# Altium schematic sheet lcd.SchDoc: 4.3" LCD - touchscreen
size A3; Author: Francesco Sacchi <batt@develer.com>; Organization: Develer s.r.l.; Address1: via Mugellese 1/A; Address2: 50019 Campi Bisenzio; Address3: Firenze; Address4: ITALY; DocumentNumber: 1; Revision: 0; SheetNumber: 1; SheetTotal: 6
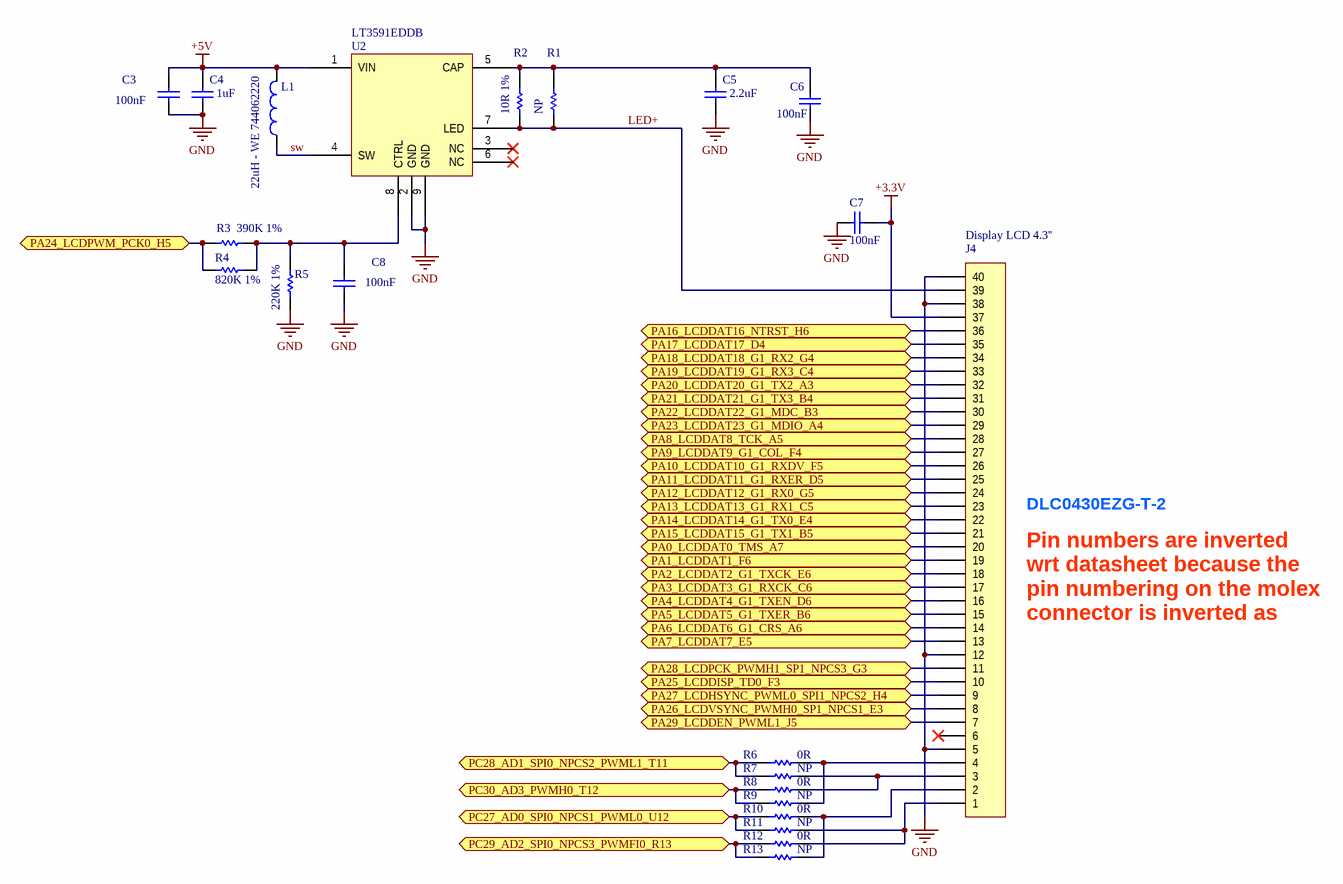
[diagram p0: lcd.SchDoc]

## Parts
C3  100nF  [0603_[1608]]
C4  1uF  [0603_[1608]]
C5  2.2uF  [1210_[3225]]
C6  100nF  [0603_[1608]]
C7  100nF  [0603_[1608]]
C8  100nF  [0603_[1608]]
J4  Display LCD 4.3''  [fcc-zif_40pin_0.5mm]
L1  22uH - WE 744062220  [WE-TPC-6823-X]
R1  NP  [0603_[1608]]
R2  10R 1%  [0603_[1608]]
R3  390K 1%  [0603_[1608]]
R4  820K 1%  [0603_[1608]]
R5  220K 1%  [0603_[1608]]
R6  0R  [0603_[1608]]
R7  NP  [0603_[1608]]
R8  0R  [0603_[1608]]
R9  NP  [0603_[1608]]
R10  0R  [0603_[1608]]
R11  NP  [0603_[1608]]
R12  0R  [0603_[1608]]
R13  NP  [0603_[1608]]
U2  LT3591EDDB  [PQFN50P300X200X75_HS-9L]

## Ports
PA0_LCDDAT0_TMS_A7, PA1_LCDDAT1_F6, PA2_LCDDAT2_G1_TXCK_E6, PA3_LCDDAT3_G1_RXCK_C6, PA4_LCDDAT4_G1_TXEN_D6, PA5_LCDDAT5_G1_TXER_B6, PA6_LCDDAT6_G1_CRS_A6, PA7_LCDDAT7_E5, PA8_LCDDAT8_TCK_A5, PA9_LCDDAT9_G1_COL_F4, PA10_LCDDAT10_G1_RXDV_F5, PA11_LCDDAT11_G1_RXER_D5, PA12_LCDDAT12_G1_RX0_G5, PA13_LCDDAT13_G1_RX1_C5, PA14_LCDDAT14_G1_TX0_E4, PA15_LCDDAT15_G1_TX1_B5, PA16_LCDDAT16_NTRST_H6, PA17_LCDDAT17_D4, PA18_LCDDAT18_G1_RX2_G4, PA19_LCDDAT19_G1_RX3_C4, PA20_LCDDAT20_G1_TX2_A3, PA21_LCDDAT21_G1_TX3_B4, PA22_LCDDAT22_G1_MDC_B3, PA23_LCDDAT23_G1_MDIO_A4, PA24_LCDPWM_PCK0_H5, PA25_LCDDISP_TD0_F3, PA26_LCDVSYNC_PWMH0_SP1_NPCS1_E3, PA27_LCDHSYNC_PWML0_SPI1_NPCS2_H4, PA28_LCDPCK_PWMH1_SP1_NPCS3_G3, PA29_LCDDEN_PWML1_J5, PC27_AD0_SPI0_NPCS1_PWML0_U12, PC28_AD1_SPI0_NPCS2_PWML1_T11, PC29_AD2_SPI0_NPCS3_PWMFI0_R13, PC30_AD3_PWMH0_T12

## Nets
+3.3V: C7.1 J4.37
+5V: C3.2 C4.2 L1.2 U2.1(VIN)
GND: C3.1 C4.1 C5.1 C6.1 C7.2 C8.1 J4.5 J4.12 J4.38 J4.40 R5.2 U2.2(GND) U2.9(GND)
LED+: J4.39 R1.1 R2.1 U2.7(LED)
PA0_LCDDAT0_TMS_A7: J4.20 ; port PA0_LCDDAT0_TMS_A7
PA1_LCDDAT1_F6: J4.19 ; port PA1_LCDDAT1_F6
PA2_LCDDAT2_G1_TXCK_E6: J4.18 ; port PA2_LCDDAT2_G1_TXCK_E6
PA3_LCDDAT3_G1_RXCK_C6: J4.17 ; port PA3_LCDDAT3_G1_RXCK_C6
PA4_LCDDAT4_G1_TXEN_D6: J4.16 ; port PA4_LCDDAT4_G1_TXEN_D6
PA5_LCDDAT5_G1_TXER_B6: J4.15 ; port PA5_LCDDAT5_G1_TXER_B6
PA6_LCDDAT6_G1_CRS_A6: J4.14 ; port PA6_LCDDAT6_G1_CRS_A6
PA7_LCDDAT7_E5: J4.13 ; port PA7_LCDDAT7_E5
PA8_LCDDAT8_TCK_A5: J4.28 ; port PA8_LCDDAT8_TCK_A5
PA9_LCDDAT9_G1_COL_F4: J4.27 ; port PA9_LCDDAT9_G1_COL_F4
PA10_LCDDAT10_G1_RXDV_F5: J4.26 ; port PA10_LCDDAT10_G1_RXDV_F5
PA11_LCDDAT11_G1_RXER_D5: J4.25 ; port PA11_LCDDAT11_G1_RXER_D5
PA12_LCDDAT12_G1_RX0_G5: J4.24 ; port PA12_LCDDAT12_G1_RX0_G5
PA13_LCDDAT13_G1_RX1_C5: J4.23 ; port PA13_LCDDAT13_G1_RX1_C5
PA14_LCDDAT14_G1_TX0_E4: J4.22 ; port PA14_LCDDAT14_G1_TX0_E4
PA15_LCDDAT15_G1_TX1_B5: J4.21 ; port PA15_LCDDAT15_G1_TX1_B5
PA16_LCDDAT16_NTRST_H6: J4.36 ; port PA16_LCDDAT16_NTRST_H6
PA17_LCDDAT17_D4: J4.35 ; port PA17_LCDDAT17_D4
PA18_LCDDAT18_G1_RX2_G4: J4.34 ; port PA18_LCDDAT18_G1_RX2_G4
PA19_LCDDAT19_G1_RX3_C4: J4.33 ; port PA19_LCDDAT19_G1_RX3_C4
PA20_LCDDAT20_G1_TX2_A3: J4.32 ; port PA20_LCDDAT20_G1_TX2_A3
PA21_LCDDAT21_G1_TX3_B4: J4.31 ; port PA21_LCDDAT21_G1_TX3_B4
PA22_LCDDAT22_G1_MDC_B3: J4.30 ; port PA22_LCDDAT22_G1_MDC_B3
PA23_LCDDAT23_G1_MDIO_A4: J4.29 ; port PA23_LCDDAT23_G1_MDIO_A4
PA24_LCDPWM_PCK0_H5: R3.2 R4.1 ; port PA24_LCDPWM_PCK0_H5
PA25_LCDDISP_TD0_F3: J4.10 ; port PA25_LCDDISP_TD0_F3
PA26_LCDVSYNC_PWMH0_SP1_NPCS1_E3: J4.8 ; port PA26_LCDVSYNC_PWMH0_SP1_NPCS1_E3
PA27_LCDHSYNC_PWML0_SPI1_NPCS2_H4: J4.9 ; port PA27_LCDHSYNC_PWML0_SPI1_NPCS2_H4
PA28_LCDPCK_PWMH1_SP1_NPCS3_G3: J4.11 ; port PA28_LCDPCK_PWMH1_SP1_NPCS3_G3
PA29_LCDDEN_PWML1_J5: J4.7 ; port PA29_LCDDEN_PWML1_J5
PC27_AD0_SPI0_NPCS1_PWML0_U12: R10.2 R11.2 ; port PC27_AD0_SPI0_NPCS1_PWML0_U12
PC28_AD1_SPI0_NPCS2_PWML1_T11: R6.2 R7.2 ; port PC28_AD1_SPI0_NPCS2_PWML1_T11
PC29_AD2_SPI0_NPCS3_PWMFI0_R13: R12.2 R13.2 ; port PC29_AD2_SPI0_NPCS3_PWMFI0_R13
PC30_AD3_PWMH0_T12: R8.2 R9.2 ; port PC30_AD3_PWMH0_T12
sw: L1.1 U2.4(SW)
NetC5_2: C5.2 C6.2 R1.2 R2.2 U2.5(CAP)
NetC8_2: C8.2 R3.1 R4.2 R5.1 U2.8(CTRL)
NetJ4_1: J4.1 R11.1 R12.1
NetJ4_2: J4.2 R10.1 R13.1
NetJ4_3: J4.3 R7.1 R8.1
NetJ4_4: J4.4 R6.1 R9.1

Not connected (* = marked no-connect by the designer): J4 6*; U2 3(NC)* 6(NC)*

## Notes on the sheet
- DLC0430EZG-T-2
- Pin numbers are inverted wrt datasheet because the pin numbering on the molex connector is inverted as well!
- Title:
- Author:
- License:
- BSD
- Rev:
- Size:
- A3
- File:
- Date:
- Time:
- Sheet
- of

## Library data of the parts
C3 C6 C8 = Cap: Ceramic X7R 50V; Value: 10nF; Published: 8-Jun-2000; Revision: July-2002: Re-released for DXP Platform.; Publisher: Altium Limited
C4 = Cap: Ceramic X7R, X5R 16V; Value: 10nF; Published: 8-Jun-2000; Revision: July-2002: Re-released for DXP Platform.; Publisher: Altium Limited
C5 = Cap: Ceramic X7R, X5R 50V; Value: 10nF; Published: 8-Jun-2000; Revision: July-2002: Re-released for DXP Platform.; Publisher: Altium Limited
C7 = Cap: Ceramic X5R 6.3V, 10V; Value: 10nF; Published: 8-Jun-2000; Revision: July-2002: Re-released for DXP Platform.; Publisher: Altium Limited
J4 = Header 40: 40-pin, 0.5mm, SMT, ZIF, Horizontal, Top Contact (WE 68714014022; Molex: 54104-4031); LatestRevisionDate: 17-Jul-2002; LatestRevisionNote: Re-released for DXP Platform.; Publisher: Altium Limited
L1 = Inductor: Power Inductor
R1 R2 = Res1: Resistor 0.125W; Value: 1K; Published: 8-Jun-2000; Revision: July-2002: Re-released for DXP Platform.; Publisher: Altium Limited
R3-R13 = Res1: Resistor; Value: 1K; Published: 8-Jun-2000; Revision: July-2002: Re-released for DXP Platform.; Publisher: Altium Limited
U2 = LT3591: White LED Driver with Integrated Schottky